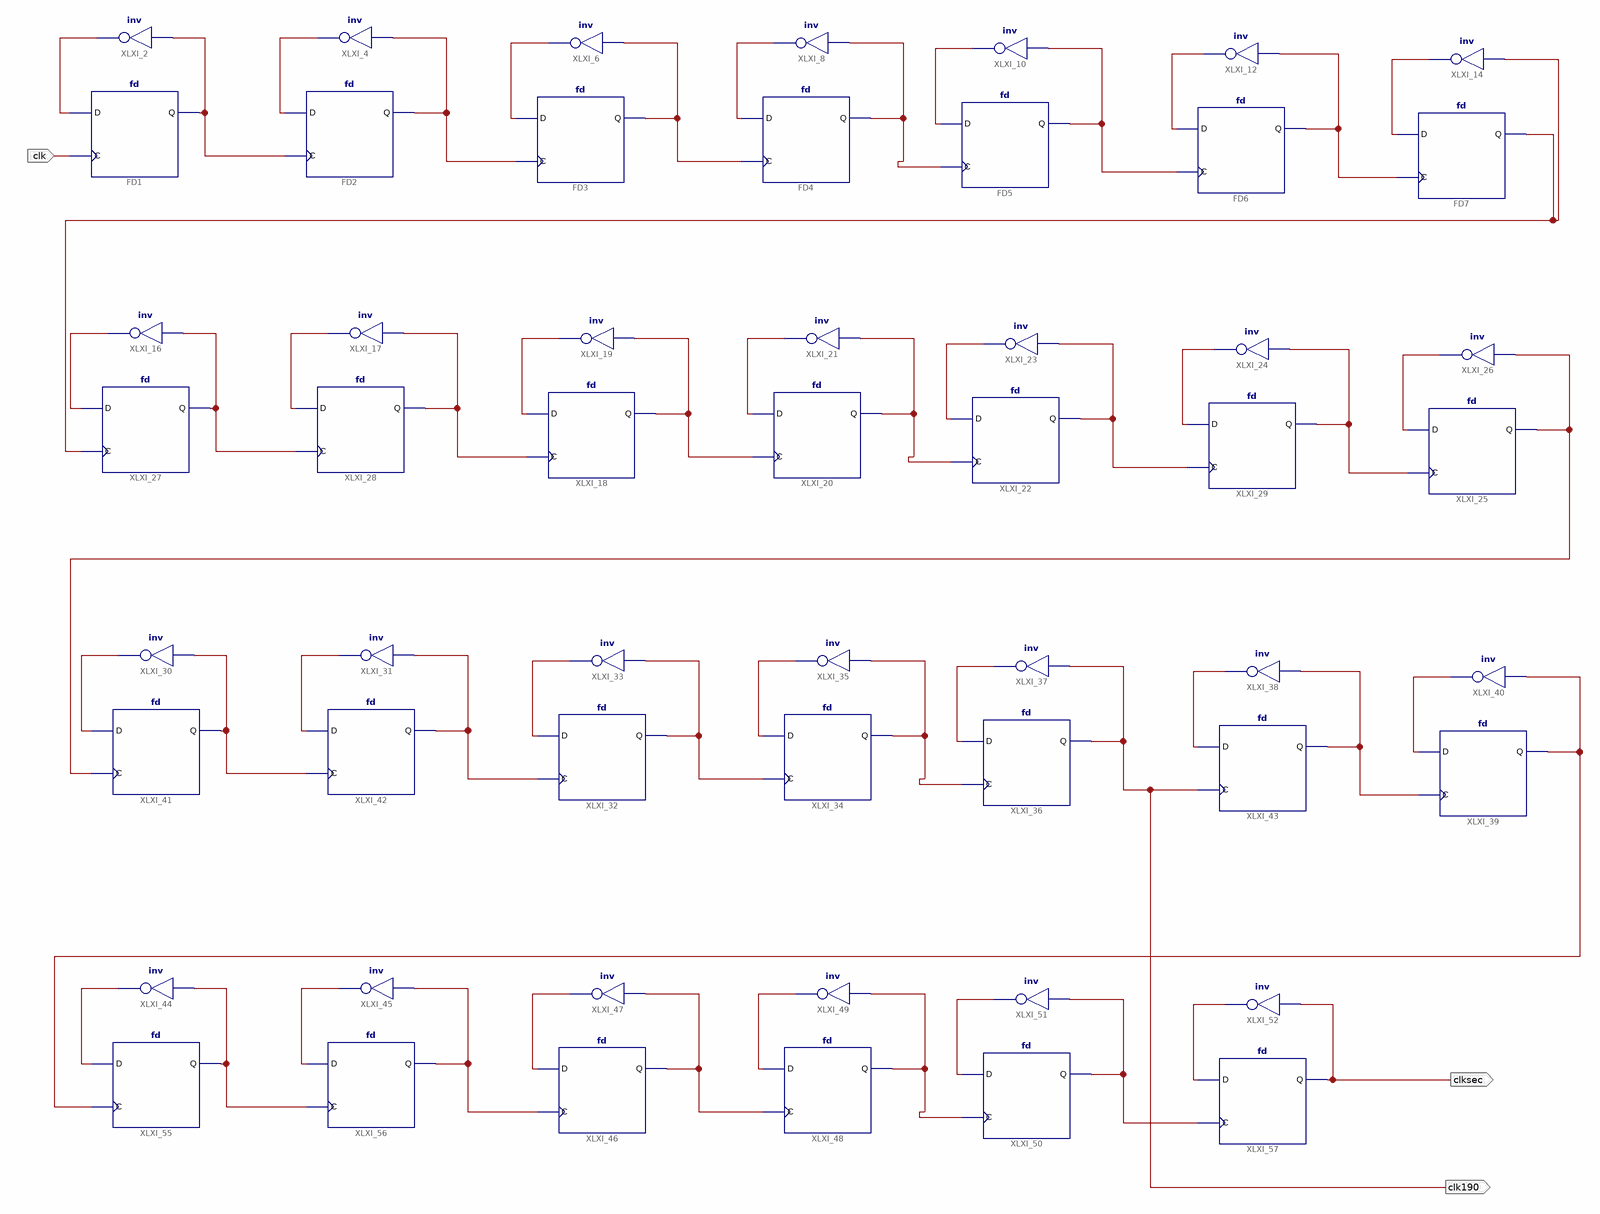
[diagram p0: schematic sheet 1]
// Xilinx ISE schematic clkdiv.sch (spartan6) as structural Verilog: 54 symbols, 3 ports
module clkdiv (
  input  clk,
  output clk190,
  output clksec
);

  wire XLXN_1, XLXN_4, XLXN_5, XLXN_6, XLXN_7, XLXN_8, XLXN_9, XLXN_10, XLXN_11, XLXN_13, XLXN_14, XLXN_19,
       XLXN_22, XLXN_23, XLXN_28, XLXN_29, XLXN_30, XLXN_31, XLXN_32, XLXN_34, XLXN_35, XLXN_36, XLXN_37,
       XLXN_38, XLXN_39, XLXN_40, XLXN_41, XLXN_42, XLXN_44, XLXN_45, XLXN_46, XLXN_47, XLXN_48, XLXN_50,
       XLXN_51, XLXN_53, XLXN_54, XLXN_55, XLXN_56, XLXN_57, XLXN_58, XLXN_60, XLXN_61, XLXN_62, XLXN_63,
       XLXN_64, XLXN_66, XLXN_67, XLXN_68, XLXN_72, XLXN_73, XLXN_74;

  not XLXI_2 (XLXN_1, XLXN_23);
  not XLXI_4 (XLXN_22, XLXN_4);
  fd FD3 (.C(XLXN_4), .D(XLXN_5), .Q(XLXN_6));
  not XLXI_6 (XLXN_5, XLXN_6);
  fd FD4 (.C(XLXN_6), .D(XLXN_7), .Q(XLXN_8));
  not XLXI_8 (XLXN_7, XLXN_8);
  fd FD5 (.C(XLXN_8), .D(XLXN_9), .Q(XLXN_10));
  not XLXI_10 (XLXN_9, XLXN_10);
  not XLXI_12 (XLXN_11, XLXN_19);
  fd FD7 (.C(XLXN_19), .D(XLXN_13), .Q(XLXN_14));
  not XLXI_14 (XLXN_13, XLXN_14);
  fd FD1 (.C(clk), .D(XLXN_1), .Q(XLXN_23));
  fd FD2 (.C(XLXN_23), .D(XLXN_22), .Q(XLXN_4));
  fd FD6 (.C(XLXN_10), .D(XLXN_11), .Q(XLXN_19));
  not XLXI_16 (XLXN_28, XLXN_41);
  not XLXI_17 (XLXN_40, XLXN_29);
  fd XLXI_18 (.C(XLXN_29), .D(XLXN_30), .Q(XLXN_31));
  not XLXI_19 (XLXN_30, XLXN_31);
  fd XLXI_20 (.C(XLXN_31), .D(XLXN_32), .Q(XLXN_34));
  not XLXI_21 (XLXN_32, XLXN_34);
  fd XLXI_22 (.C(XLXN_34), .D(XLXN_35), .Q(XLXN_36));
  not XLXI_23 (XLXN_35, XLXN_36);
  not XLXI_24 (XLXN_42, XLXN_39);
  fd XLXI_25 (.C(XLXN_39), .D(XLXN_37), .Q(XLXN_38));
  not XLXI_26 (XLXN_37, XLXN_38);
  fd XLXI_27 (.C(XLXN_14), .D(XLXN_28), .Q(XLXN_41));
  fd XLXI_28 (.C(XLXN_41), .D(XLXN_40), .Q(XLXN_29));
  fd XLXI_29 (.C(XLXN_36), .D(XLXN_42), .Q(XLXN_39));
  not XLXI_30 (XLXN_44, XLXN_57);
  not XLXI_31 (XLXN_56, XLXN_45);
  fd XLXI_32 (.C(XLXN_45), .D(XLXN_46), .Q(XLXN_47));
  not XLXI_33 (XLXN_46, XLXN_47);
  fd XLXI_34 (.C(XLXN_47), .D(XLXN_48), .Q(XLXN_50));
  not XLXI_35 (XLXN_48, XLXN_50);
  fd XLXI_36 (.C(XLXN_50), .D(XLXN_51), .Q(clk190));
  not XLXI_37 (XLXN_51, clk190);
  not XLXI_38 (XLXN_58, XLXN_55);
  fd XLXI_39 (.C(XLXN_55), .D(XLXN_53), .Q(XLXN_54));
  not XLXI_40 (XLXN_53, XLXN_54);
  fd XLXI_41 (.C(XLXN_38), .D(XLXN_44), .Q(XLXN_57));
  fd XLXI_42 (.C(XLXN_57), .D(XLXN_56), .Q(XLXN_45));
  fd XLXI_43 (.C(clk190), .D(XLXN_58), .Q(XLXN_55));
  not XLXI_44 (XLXN_60, XLXN_73);
  not XLXI_45 (XLXN_72, XLXN_61);
  fd XLXI_46 (.C(XLXN_61), .D(XLXN_62), .Q(XLXN_63));
  not XLXI_47 (XLXN_62, XLXN_63);
  fd XLXI_48 (.C(XLXN_63), .D(XLXN_64), .Q(XLXN_66));
  not XLXI_49 (XLXN_64, XLXN_66);
  fd XLXI_50 (.C(XLXN_66), .D(XLXN_67), .Q(XLXN_68));
  not XLXI_51 (XLXN_67, XLXN_68);
  not XLXI_52 (XLXN_74, clksec);
  fd XLXI_55 (.C(XLXN_54), .D(XLXN_60), .Q(XLXN_73));
  fd XLXI_56 (.C(XLXN_73), .D(XLXN_72), .Q(XLXN_61));
  fd XLXI_57 (.C(XLXN_68), .D(XLXN_74), .Q(clksec));
endmodule
